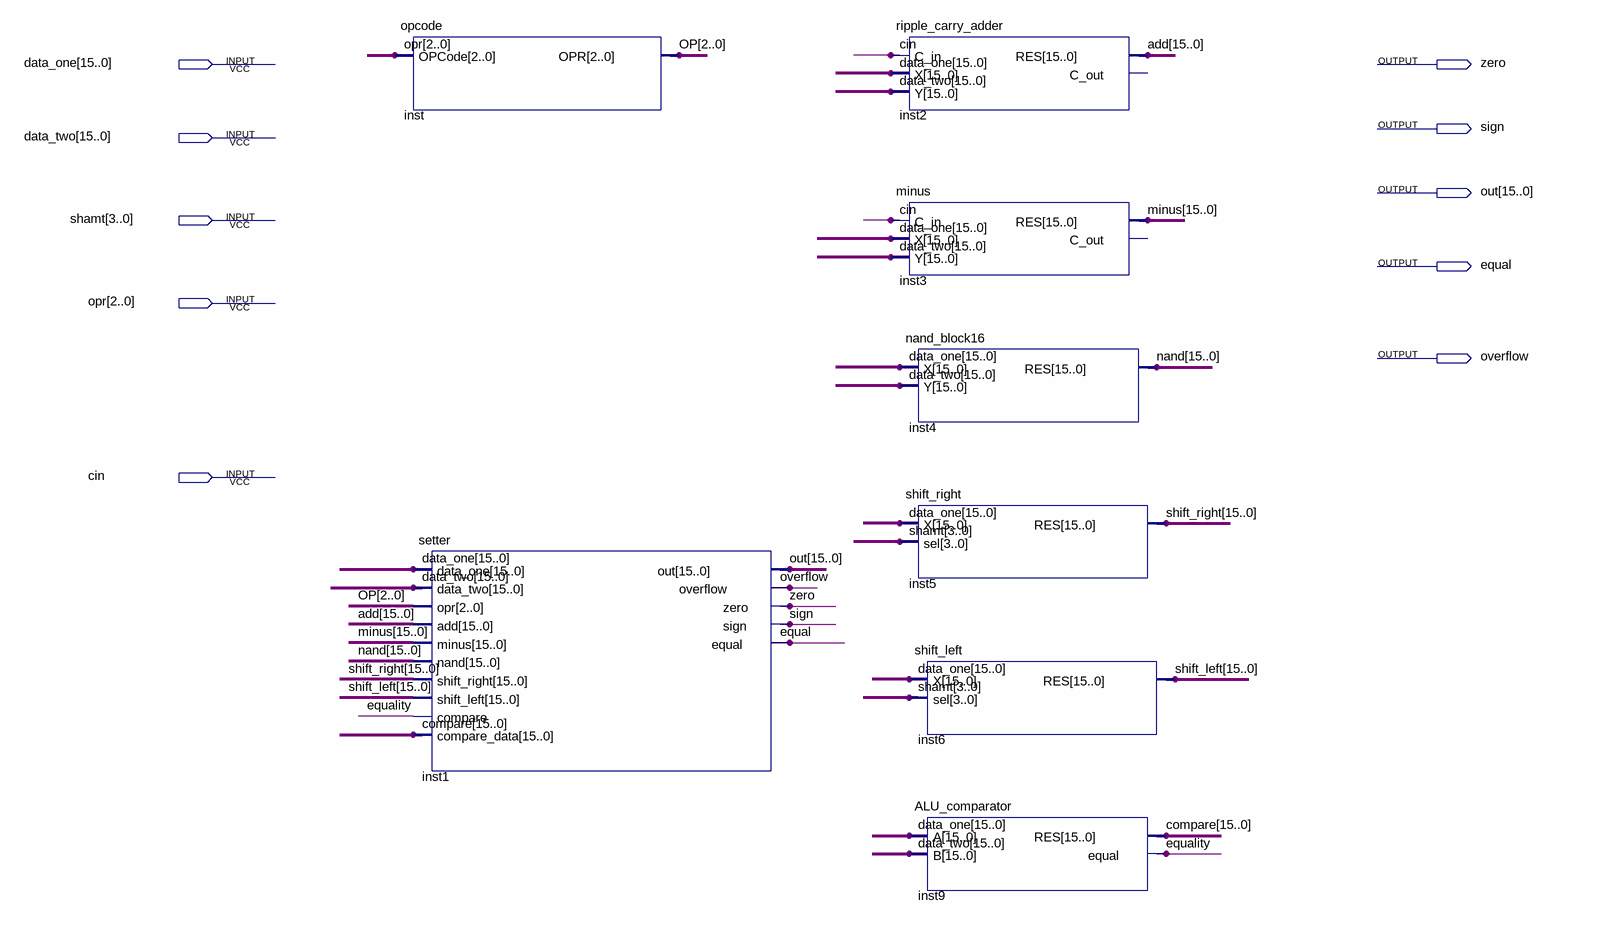
[diagram p0: schematic sheet]
// Quartus schematic ALU.bdf as structural Verilog: 8 symbols, 10 pins
module ALU (
  input  [15:0] data_one,
  input  [15:0] data_two,
  input  [3:0] shamt,
  input  [2:0] opr,
  input  cin,
  output zero,
  output sign,
  output [15:0] out,
  output equal,
  output overflow
);

  wire equality;
  wire [2:0] OP;
  wire [15:0] add, compare, minus, \nand , shift_left, shift_right;

  opcode inst (.OPCode(opr), .OPR(OP));
  setter inst1 (
    .data_one(data_one), .data_two(data_two), .opr(OP), .add(add), .minus(minus), .\nand (\nand ),
    .shift_right(shift_right), .shift_left(shift_left), .compare(equality), .compare_data(compare),
    .out(out), .overflow(overflow), .zero(zero), .sign(sign), .equal(equal));
  ripple_carry_adder inst2 (.C_in(cin), .X(data_one), .Y(data_two), .RES(add));  // open: C_out
  minus inst3 (.C_in(cin), .X(data_one), .Y(data_two), .RES(minus));  // open: C_out
  nand_block16 inst4 (.X(data_one), .Y(data_two), .RES(\nand ));
  shift_right inst5 (.X(data_one), .sel(shamt), .RES(shift_right));
  shift_left inst6 (.X(data_one), .sel(shamt), .RES(shift_left));
  ALU_comparator inst9 (.A(data_one), .B(data_two), .RES(compare), .equal(equality));
endmodule
